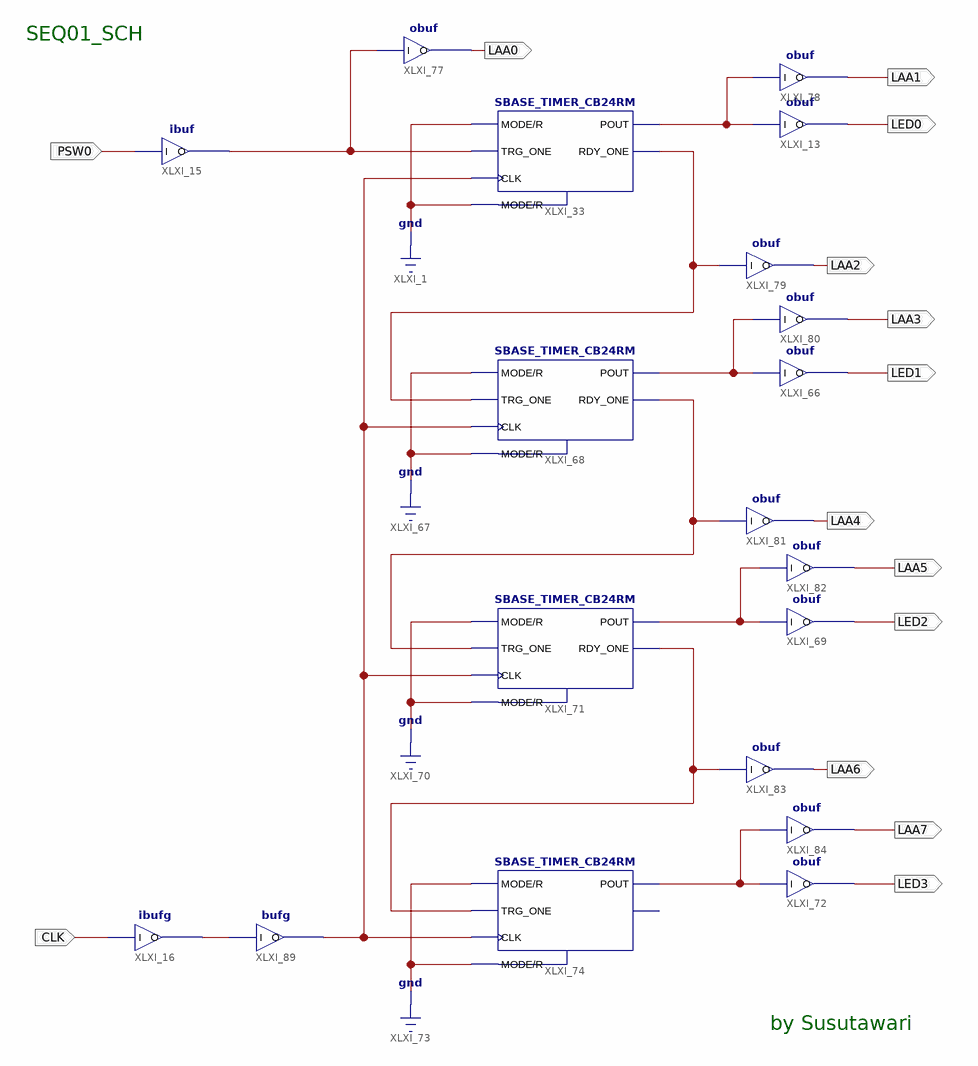
[diagram p0: schematic sheet 1]
// Xilinx ISE schematic SEQ01_SCH.sch (spartan3a) as structural Verilog: 19 symbols, 14 ports
module SEQ01_SCH (
  input  CLK,
  input  PSW0,
  output LED1,
  output LED2,
  output LED3,
  output LAA0,
  output LAA2,
  output LAA3,
  output LAA4,
  output LAA5,
  output LAA6,
  output LAA7,
  output LAA1,
  output LED0
);

  wire XLXN_111, XLXN_113, XLXN_114, XLXN_141, XLXN_142, XLXN_143, XLXN_144, XLXN_160, XLXN_163, XLXN_167;

  SBASE_TIMER_CB24RM XLXI_33 (
    .CLK(XLXN_163), .TRG_ONE(XLXN_167), .MODE(1'b0), .POUT(XLXN_141), .RDY_ONE(XLXN_111), .R(1'b0));
  SBASE_TIMER_CB24RM XLXI_68 (
    .CLK(XLXN_163), .TRG_ONE(XLXN_111), .MODE(1'b0), .POUT(XLXN_142), .RDY_ONE(XLXN_113), .R(1'b0));
  SBASE_TIMER_CB24RM XLXI_71 (
    .CLK(XLXN_163), .TRG_ONE(XLXN_113), .MODE(1'b0), .POUT(XLXN_143), .RDY_ONE(XLXN_114), .R(1'b0));
  SBASE_TIMER_CB24RM XLXI_74 (
    .CLK(XLXN_163), .TRG_ONE(XLXN_114), .MODE(1'b0), .POUT(XLXN_144), .R(1'b0));  // open: RDY_ONE
  obuf XLXI_77 (.I(XLXN_167), .O(LAA0));
  obuf XLXI_79 (.I(XLXN_111), .O(LAA2));
  obuf XLXI_81 (.I(XLXN_113), .O(LAA4));
  obuf XLXI_83 (.I(XLXN_114), .O(LAA6));
  obuf XLXI_13 (.I(XLXN_141), .O(LED0));
  obuf XLXI_78 (.I(XLXN_141), .O(LAA1));
  obuf XLXI_80 (.I(XLXN_142), .O(LAA3));
  obuf XLXI_66 (.I(XLXN_142), .O(LED1));
  obuf XLXI_82 (.I(XLXN_143), .O(LAA5));
  obuf XLXI_69 (.I(XLXN_143), .O(LED2));
  obuf XLXI_72 (.I(XLXN_144), .O(LED3));
  obuf XLXI_84 (.I(XLXN_144), .O(LAA7));
  ibufg XLXI_16 (.I(CLK), .O(XLXN_160));
  bufg XLXI_89 (.I(XLXN_160), .O(XLXN_163));
  ibuf XLXI_15 (.I(PSW0), .O(XLXN_167));

  // Notes on the sheet:
  //   SEQ01_SCH
  //   by Susutawari
endmodule
